# Altium project Inv_filter_v1.PrjPcb (part 1 of 2)
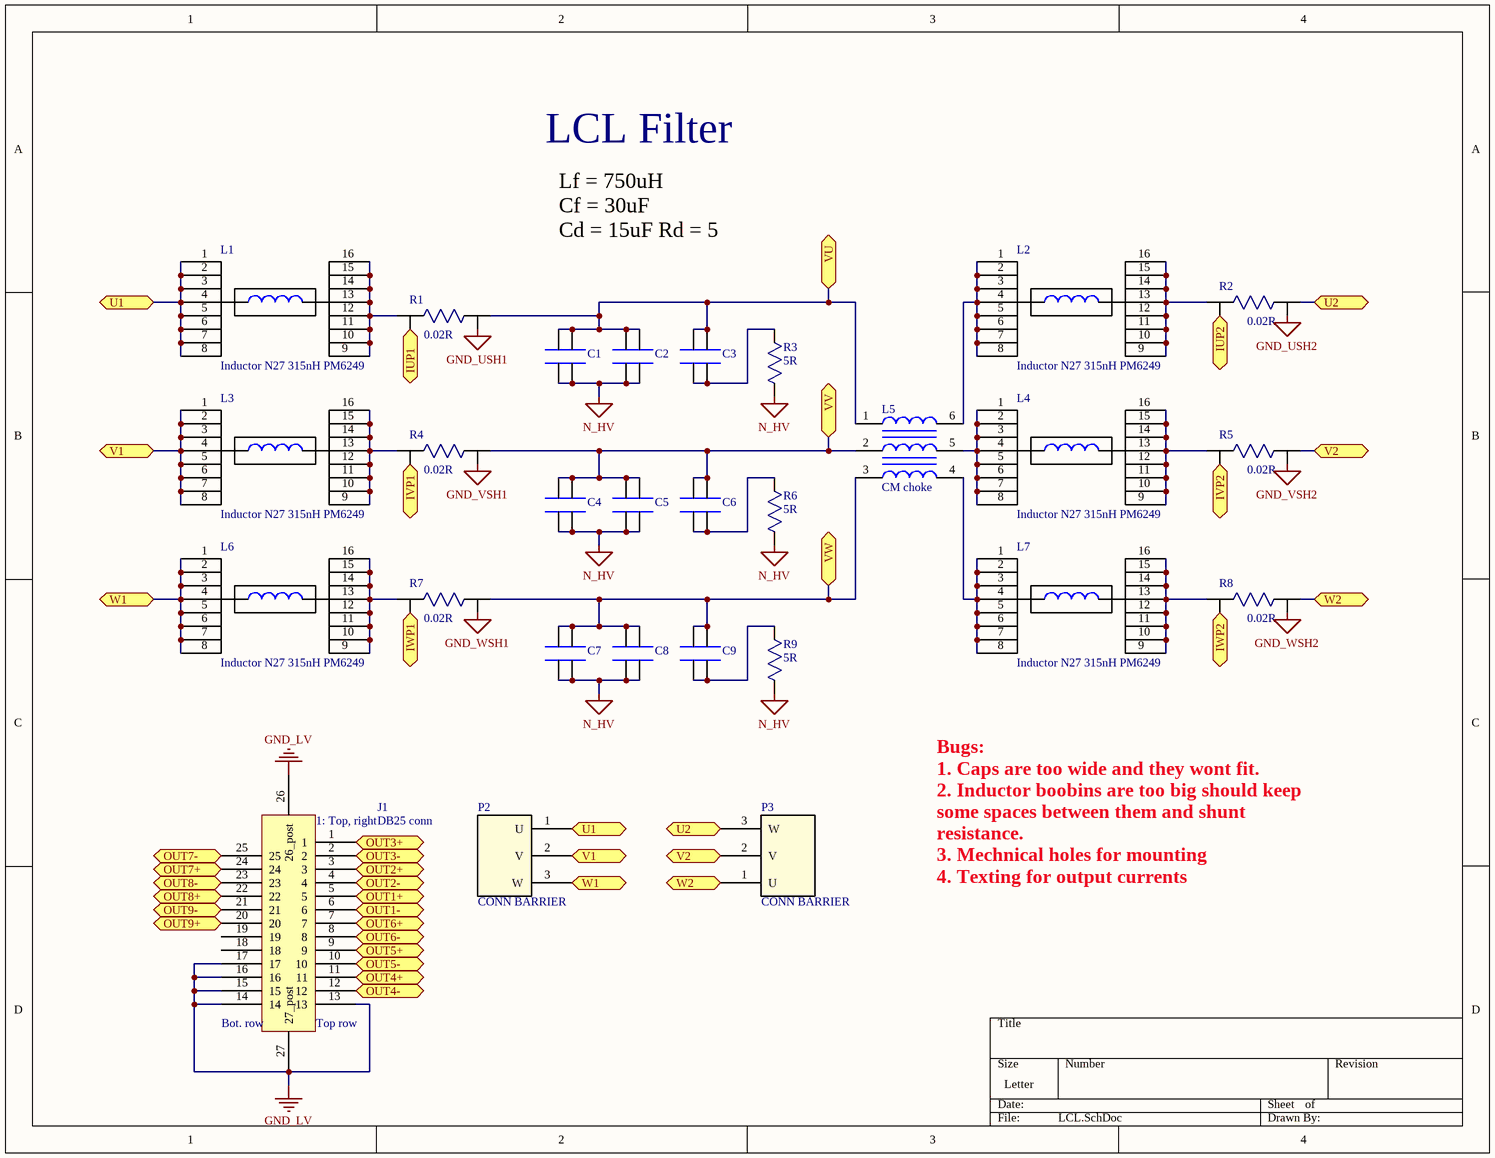
[diagram p0: LCL.SchDoc]
5 sheets, 433 parts. Net scope: flat (ports and power ports of the same name join across sheets).
Board file: Inc_filter_v1.PcbDoc
Sheets:
  LCL.SchDoc
  Ind_current_sensor_VW.SchDoc
  Ind_current_sensor_U.SchDoc
  Voltage_sensor_UVW.SchDoc
  Out_current_sensor_UVW.SchDoc

## Sheet LCL.SchDoc
size Letter

### Parts
C1  *  [Radial - 4 Leads]  (value not drawn)
C2  *  [Radial - 4 Leads]  (value not drawn)
C3  *  [Radial - 4 Leads]  (value not drawn)
C4  *  [Radial - 4 Leads]  (value not drawn)
C5  *  [Radial - 4 Leads]  (value not drawn)
C6  *  [Radial - 4 Leads]  (value not drawn)
C7  *  [Radial - 4 Leads]  (value not drawn)
C8  *  [Radial - 4 Leads]  (value not drawn)
C9  *  [Radial - 4 Leads]  (value not drawn)
J1  DB25 conn  [Connector D-Sub Receptacle 25 pos]
L1  Inductor N27 315nH PM6249  [IND_PM6249]
L2  Inductor N27 315nH PM6249  [IND_PM6249]
L3  Inductor N27 315nH PM6249  [IND_PM6249]
L4  Inductor N27 315nH PM6249  [IND_PM6249]
L5  CM choke  [CM Choke]
L6  Inductor N27 315nH PM6249  [IND_PM6249]
L7  Inductor N27 315nH PM6249  [IND_PM6249]
P2  CONN BARRIER  [Terminal Barrier 3PIN]
P3  CONN BARRIER  [Terminal Barrier 3PIN]
R1  value 0.02R  [Res Precision CSM3637Z]  (hidden comment: Resistor Precision)
R2  value 0.02R  [Res Precision CSM3637Z]  (hidden comment: Resistor Precision)
R3  value 5R  [Axial 50mm]  (hidden comment: Resistor Power)
R4  value 0.02R  [Res Precision CSM3637Z]  (hidden comment: Resistor Precision)
R5  value 0.02R  [Res Precision CSM3637Z]  (hidden comment: Resistor Precision)
R6  value 5R  [Axial 50mm]  (hidden comment: Resistor Power)
R7  value 0.02R  [Res Precision CSM3637Z]  (hidden comment: Resistor Precision)
R8  value 0.02R  [Res Precision CSM3637Z]  (hidden comment: Resistor Precision)
R9  value 5R  [Axial 50mm]  (hidden comment: Resistor Power)

### Ports
IUP1, IUP2, IVP1, IVP2, IWP1, IWP2, OUT1+, OUT1-, OUT2+, OUT2-, OUT3+, OUT3-, OUT4+, OUT4-, OUT5+, OUT5-, OUT6+, OUT6-, OUT7+, OUT7-, OUT8+, OUT8-, OUT9+, OUT9-, U1, U2, V1, V2, VU, VV, VW, W1, W2

### Nets
GND_LV: J1.13 J1.14 J1.15 J1.16 J1.17 J1.26(26_post) J1.27(27_post)
GND_USH1: R1.2
GND_USH2: R2.2
GND_VSH1: R4.2
GND_VSH2: R5.2
GND_WSH1: R7.2
GND_WSH2: R8.2
N_HV: C1.1(OUT) C1.2(OUT) C2.1(OUT) C2.2(OUT) C4.1(OUT) C4.2(OUT) C5.1(OUT) C5.2(OUT) C7.1(OUT) C7.2(OUT) C8.1(OUT) C8.2(OUT) R3.1 R6.1 R9.1
NetC1_3: C1.3(OUT) C1.4(OUT) C2.3(OUT) C2.4(OUT) C3.3(OUT) C3.4(OUT) L5.1 R1.1 ; port VU
NetC3_1: C3.1(OUT) C3.2(OUT) R3.2
NetC4_3: C4.3(OUT) C4.4(OUT) C5.3(OUT) C5.4(OUT) C6.3(OUT) C6.4(OUT) L5.2 R4.1 ; port VV
NetC6_1: C6.1(OUT) C6.2(OUT) R6.2
NetC7_3: C7.3(OUT) C7.4(OUT) C8.3(OUT) C8.4(OUT) C9.3(OUT) C9.4(OUT) L5.3 R7.1 ; port VW
NetC9_1: C9.1(OUT) C9.2(OUT) R9.2
NetFB1_1: R4.3 ; port IVP1
NetFB5_1: R1.3 ; port IUP1
NetFB9_1: R7.3 ; port IWP1
NetFB18_1: R2.3 ; port IUP2
NetFB22_1: R5.3 ; port IVP2
NetFB26_1: R8.3 ; port IWP2
NetJ1_1: J1.1 ; port OUT3+
NetJ1_2: J1.2 ; port OUT3-
NetJ1_3: J1.3 ; port OUT2+
NetJ1_4: J1.4 ; port OUT2-
NetJ1_5: J1.5 ; port OUT1+
NetJ1_6: J1.6 ; port OUT1-
NetJ1_7: J1.7 ; port OUT6+
NetJ1_8: J1.8 ; port OUT6-
NetJ1_9: J1.9 ; port OUT5+
NetJ1_10: J1.10 ; port OUT5-
NetJ1_11: J1.11 ; port OUT4+
NetJ1_12: J1.12 ; port OUT4-
NetJ1_20: J1.20 ; port OUT9+
NetJ1_21: J1.21 ; port OUT9-
NetJ1_22: J1.22 ; port OUT8+
NetJ1_23: J1.23 ; port OUT8-
NetJ1_24: J1.24 ; port OUT7+
NetJ1_25: J1.25 ; port OUT7-
NetL1_1: L1.1 L1.2 L1.3 L1.4 L1.5 L1.6 L1.7 L1.8 P2.1(U) ; port U1
NetL1_9: L1.9 L1.10 L1.11 L1.12 L1.13 L1.14 L1.15 L1.16 R1.4
NetL2_1: L2.1 L2.2 L2.3 L2.4 L2.5 L2.6 L2.7 L2.8 L5.6
NetL2_9: L2.9 L2.10 L2.11 L2.12 L2.13 L2.14 L2.15 L2.16 R2.4
NetL3_1: L3.1 L3.2 L3.3 L3.4 L3.5 L3.6 L3.7 L3.8 P2.2(V) ; port V1
NetL3_9: L3.9 L3.10 L3.11 L3.12 L3.13 L3.14 L3.15 L3.16 R4.4
NetL4_1: L4.1 L4.2 L4.3 L4.4 L4.5 L4.6 L4.7 L4.8 L5.5
NetL4_9: L4.9 L4.10 L4.11 L4.12 L4.13 L4.14 L4.15 L4.16 R5.4
NetL5_4: L5.4 L7.1 L7.2 L7.3 L7.4 L7.5 L7.6 L7.7 L7.8
NetL6_1: L6.1 L6.2 L6.3 L6.4 L6.5 L6.6 L6.7 L6.8 P2.3(W) ; port W1
NetL6_9: L6.9 L6.10 L6.11 L6.12 L6.13 L6.14 L6.15 L6.16 R7.4
NetL7_9: L7.9 L7.10 L7.11 L7.12 L7.13 L7.14 L7.15 L7.16 R8.4
NetP3_1: P3.1(U) R8.1 ; port W2
NetP3_2: P3.2(V) R5.1 ; port V2
NetP3_3: P3.3(W) R2.1 ; port U2

Not connected (* = marked no-connect by the designer): J1 18 19

### Notes on the sheet
- LCL Filter
- Lf = 750uH
  Cf = 30uF
  Cd = 15uF Rd = 5
  Lm = 300uH
- Bugs:
  1. Caps are too wide and they wont fit.
  2. Inductor boobins are too big should keep some spaces between them and shunt resistance.
  3. Mechnical holes for mounting
  4. Texting for output currents
- (in symbol Conn D-Sub Receptacle 25 positions) 1: Top, right; Bot. row; Top row

### Library data of the parts
C1-C9 = Cap Film Radial - 4 Leads: Radial - 4 Leads; Part: BC2763-ND
J1 = Conn D-Sub Receptacle 25 positions: D-Sub Receptacle 25 Position A35111-ND; Part: A35111-ND
L5 = CMC 1.5MH 20A: CMC 1.5MH 20A 3LN TH; Part: B82747E6203A40
P2 P3 = Terminal Blocks - Barrier Blocks: CONN BARRIER STRIP 3CIRC 0.325"; Part: WM4246-ND
R1 R2 R4 R5 R7 R8 = Resistor Precision: RES SMD 0.02 OHM 0.1% 2W 3637; Part: Y1473-.02CCT-ND
R3 R6 R9 = Resistor Power: RES 5.0 OHM 10W 1% WW AXIAL; Part: RSD-5.0RCT-ND

## Sheet Ind_current_sensor_VW.SchDoc
size 304 x 482 mm
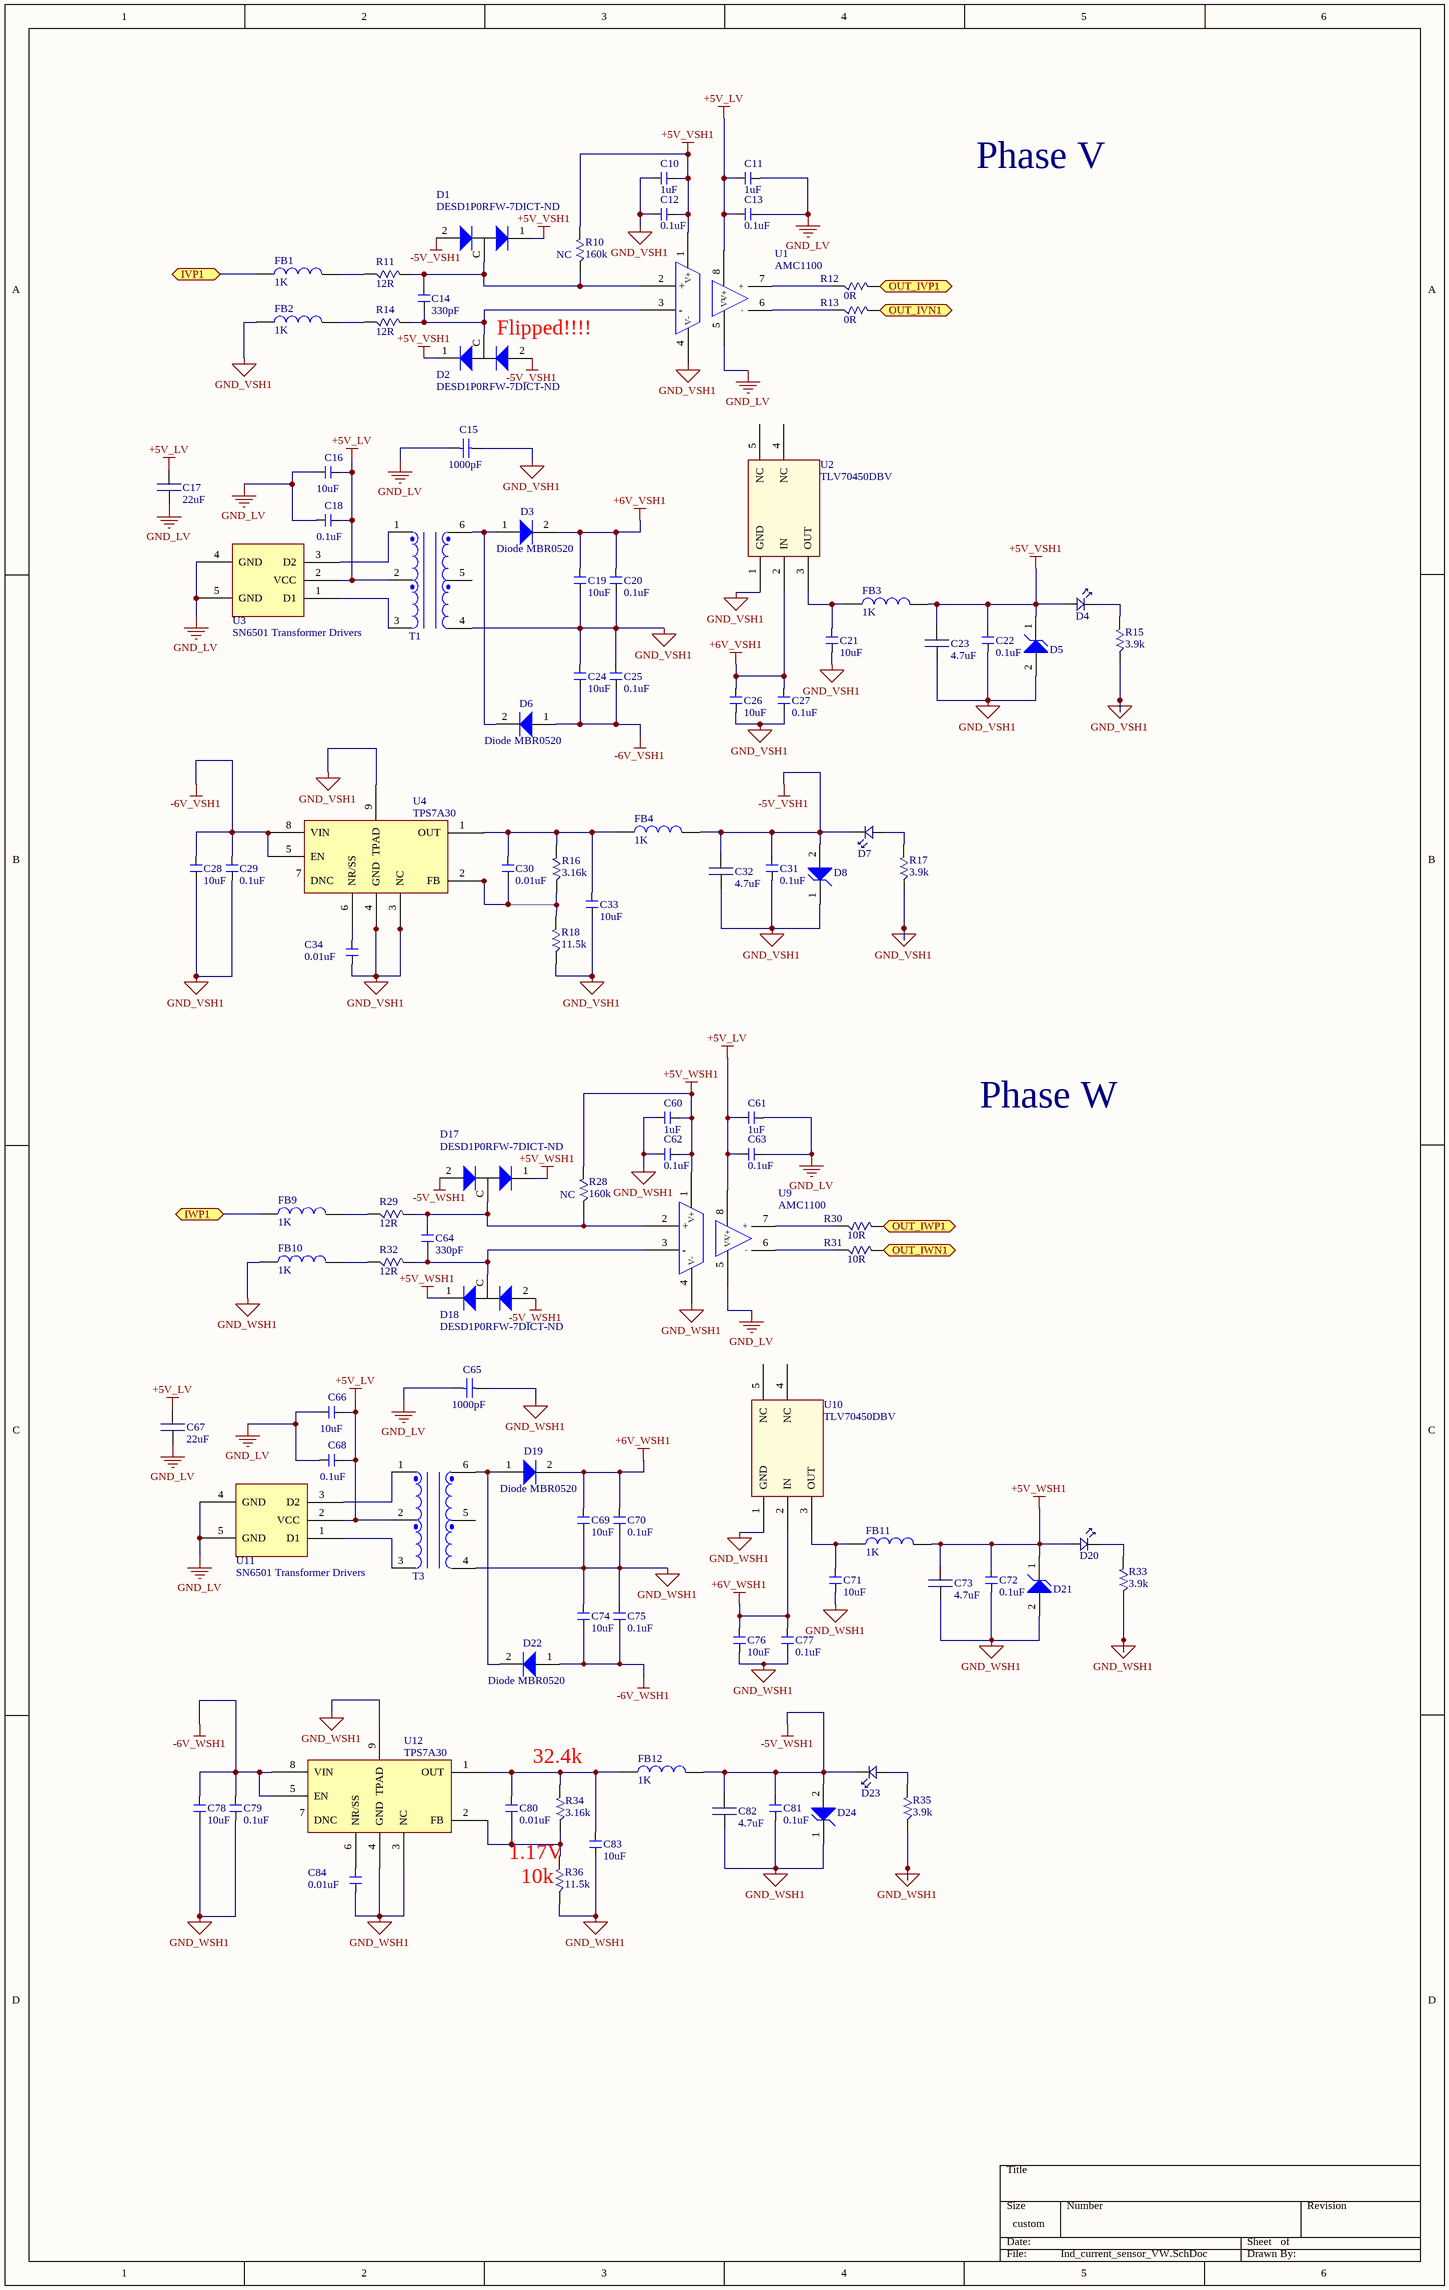
[diagram p1: Ind_current_sensor_VW.SchDoc]

### Parts
C10  value 1uF  [0603 (1608 Metric)]  (hidden comment: Cap 0603_new)
C11  value 1uF  [0603 (1608 Metric)]  (hidden comment: Cap 0603_new)
C12  value 0.1uF  [0603 (1608 Metric)]  (hidden comment: Cap 0603_new)
C13  value 0.1uF  [0603 (1608 Metric)]  (hidden comment: Cap 0603_new)
C14  value 330pF  [0603 (1608 Metric)]  (hidden comment: Cap 0603_new)
C15  value 1000pF  [RAD-0.3]  (hidden comment: Cap TH)
C16  value 10uF  [0603 (1608 Metric)]  (hidden comment: Cap 0603_new)
C17  value 22uF  [0805 (2012 metric)]  (hidden comment: Cap 0805)
C18  value 0.1uF  [0603 (1608 Metric)]  (hidden comment: Cap 0603_new)
C19  value 10uF  [0603 (1608 Metric)]  (hidden comment: Cap 0603_new)
C20  value 0.1uF  [0603 (1608 Metric)]  (hidden comment: Cap 0603_new)
C21  value 10uF  [0603 (1608 Metric)]  (hidden comment: Cap 0603_new)
C22  value 0.1uF  [0603 (1608 Metric)]  (hidden comment: Cap 0603_new)
C23  value 4.7uF  [0805 (2012 metric)]  (hidden comment: Cap 0805)
C24  value 10uF  [0603 (1608 Metric)]  (hidden comment: Cap 0603_new)
C25  value 0.1uF  [0603 (1608 Metric)]  (hidden comment: Cap 0603_new)
C26  value 10uF  [0603 (1608 Metric)]  (hidden comment: Cap 0603_new)
C27  value 0.1uF  [0603 (1608 Metric)]  (hidden comment: Cap 0603_new)
C28  value 10uF  [0603 (1608 Metric)]  (hidden comment: Cap 0603_new)
C29  value 0.1uF  [0603 (1608 Metric)]  (hidden comment: Cap 0603_new)
C30  value 0.01uF  [0603 (1608 Metric)]  (hidden comment: Cap 0603_new)
C31  value 0.1uF  [0603 (1608 Metric)]  (hidden comment: Cap 0603_new)
C32  value 4.7uF  [0805 (2012 metric)]  (hidden comment: Cap 0805)
C33  value 10uF  [0603 (1608 Metric)]  (hidden comment: Cap 0603_new)
C34  value 0.01uF  [0603 (1608 Metric)]  (hidden comment: Cap 0603_new)
C60  value 1uF  [0603 (1608 Metric)]  (hidden comment: Cap 0603_new)
C61  value 1uF  [0603 (1608 Metric)]  (hidden comment: Cap 0603_new)
C62  value 0.1uF  [0603 (1608 Metric)]  (hidden comment: Cap 0603_new)
C63  value 0.1uF  [0603 (1608 Metric)]  (hidden comment: Cap 0603_new)
C64  value 330pF  [0603 (1608 Metric)]  (hidden comment: Cap 0603_new)
C65  value 1000pF  [RAD-0.3]  (hidden comment: Cap TH)
C66  value 10uF  [0603 (1608 Metric)]  (hidden comment: Cap 0603_new)
C67  value 22uF  [0805 (2012 metric)]  (hidden comment: Cap 0805)
C68  value 0.1uF  [0603 (1608 Metric)]  (hidden comment: Cap 0603_new)
C69  value 10uF  [0603 (1608 Metric)]  (hidden comment: Cap 0603_new)
C70  value 0.1uF  [0603 (1608 Metric)]  (hidden comment: Cap 0603_new)
C71  value 10uF  [0603 (1608 Metric)]  (hidden comment: Cap 0603_new)
C72  value 0.1uF  [0603 (1608 Metric)]  (hidden comment: Cap 0603_new)
C73  value 4.7uF  [0805 (2012 metric)]  (hidden comment: Cap 0805)
C74  value 10uF  [0603 (1608 Metric)]  (hidden comment: Cap 0603_new)
C75  value 0.1uF  [0603 (1608 Metric)]  (hidden comment: Cap 0603_new)
C76  value 10uF  [0603 (1608 Metric)]  (hidden comment: Cap 0603_new)
C77  value 0.1uF  [0603 (1608 Metric)]  (hidden comment: Cap 0603_new)
C78  value 10uF  [0603 (1608 Metric)]  (hidden comment: Cap 0603_new)
C79  value 0.1uF  [0603 (1608 Metric)]  (hidden comment: Cap 0603_new)
C80  value 0.01uF  [0603 (1608 Metric)]  (hidden comment: Cap 0603_new)
C81  value 0.1uF  [0603 (1608 Metric)]  (hidden comment: Cap 0603_new)
C82  value 4.7uF  [0805 (2012 metric)]  (hidden comment: Cap 0805)
C83  value 10uF  [0603 (1608 Metric)]  (hidden comment: Cap 0603_new)
C84  value 0.01uF  [0603 (1608 Metric)]  (hidden comment: Cap 0603_new)
D1  Part: DESD1P0RFW-7DICT-ND  [SOT323_ESD]  (hidden comment: TVS - Diodes)
D2  Part: DESD1P0RFW-7DICT-ND  [SOT323_ESD]  (hidden comment: TVS - Diodes)
D3  Diode MBR0520  [SOD-123]
D4  LED  [0805 (2012 Metric) Diode]  (value not drawn)
D5  *  [POWERDI]  (value not drawn)
D6  Diode MBR0520  [SOD-123]
D7  LED  [0805 (2012 Metric) Diode]  (value not drawn)
D8  *  [POWERDI]  (value not drawn)
D17  Part: DESD1P0RFW-7DICT-ND  [SOT323_ESD]  (hidden comment: TVS - Diodes)
D18  Part: DESD1P0RFW-7DICT-ND  [SOT323_ESD]  (hidden comment: TVS - Diodes)
D19  Diode MBR0520  [SOD-123]
D20  LED  [0805 (2012 Metric) Diode]  (value not drawn)
D21  *  [POWERDI]  (value not drawn)
D22  Diode MBR0520  [SOD-123]
D23  LED  [0805 (2012 Metric) Diode]  (value not drawn)
D24  *  [POWERDI]  (value not drawn)
FB1  value 1K  [0603 (1608 Metric)]  (hidden comment: Ferrite bead)
FB2  value 1K  [0603 (1608 Metric)]  (hidden comment: Ferrite bead)
FB3  value 1K  [0603 (1608 Metric)]  (hidden comment: Ferrite bead)
FB4  value 1K  [0603 (1608 Metric)]  (hidden comment: Ferrite bead)
FB9  value 1K  [0603 (1608 Metric)]  (hidden comment: Ferrite bead)
FB10  value 1K  [0603 (1608 Metric)]  (hidden comment: Ferrite bead)
FB11  value 1K  [0603 (1608 Metric)]  (hidden comment: Ferrite bead)
FB12  value 1K  [0603 (1608 Metric)]  (hidden comment: Ferrite bead)
R10  NC  value 160k  [0603 (1608 Metric)]
R11  value 12R  [1206]  (hidden comment: Resistor 1206)
R12  value 0R  [0603 (1608 Metric)]  (hidden comment: Resistor 0603)
R13  value 0R  [0603 (1608 Metric)]  (hidden comment: Resistor 0603)
R14  value 12R  [1206]  (hidden comment: Resistor 1206)
R15  value 3.9k  [0603 (1608 Metric)]  (hidden comment: Resistor 0603)
R16  value 3.16k  [0603 (1608 Metric)]  (hidden comment: Resistor 0603)
R17  value 3.9k  [0603 (1608 Metric)]  (hidden comment: Resistor 0603)
R18  value 11.5k  [0603 (1608 Metric)]  (hidden comment: Resistor 0603)
R28  NC  value 160k  [0603 (1608 Metric)]
R29  value 12R  [1206]  (hidden comment: Resistor 1206)
R30  value 10R  [0603 (1608 Metric)]  (hidden comment: Resistor 0603)
R31  value 10R  [0603 (1608 Metric)]  (hidden comment: Resistor 0603)
R32  value 12R  [1206]  (hidden comment: Resistor 1206)
R33  value 3.9k  [0603 (1608 Metric)]  (hidden comment: Resistor 0603)
R34  value 3.16k  [0603 (1608 Metric)]  (hidden comment: Resistor 0603)
R35  value 3.9k  [0603 (1608 Metric)]  (hidden comment: Resistor 0603)
R36  value 11.5k  [0603 (1608 Metric)]  (hidden comment: Resistor 0603)
T1  750313769  [Xmr SN6501]  (value not drawn)
T3  750313769  [Xmr SN6501]  (value not drawn)
U1  AMC1100  [SOIC8]
U2  TLV70450DBV  [SOT23-5]
U3  SN6501 Transformer Drivers  [SOT23-5]
U4  TPS7A30  [8-TSSOP]
U9  AMC1100  [SOIC8]
U10  TLV70450DBV  [SOT23-5]
U11  SN6501 Transformer Drivers  [SOT23-5]
U12  TPS7A30  [8-TSSOP]

### Ports
IVP1, IWP1, OUT_IVN1, OUT_IVP1, OUT_IWN1, OUT_IWP1

### Nets
+5V_LV: C11.1(OUT) C13.1(OUT) C16.2(OUT) C17.2(OUT) C18.2(OUT) C61.1(OUT) C63.1(OUT) C66.2(OUT) C67.2(OUT) C68.2(OUT) T1.2 T3.2 U1.8(V+) U3.2(VCC) U9.8(V+) U11.2(VCC)
+5V_VSH1: C10.2(OUT) C12.2(OUT) C22.2(OUT) C23.2(OUT) D1.1(Anode) D2.1(Anode) D4.A D5.1(Anode) FB3.2(OUT) R10.2(A) U1.1(V+)
+5V_WSH1: C60.2(OUT) C62.2(OUT) C72.2(OUT) C73.2(OUT) D17.1(Anode) D18.1(Anode) D20.A D21.1(Anode) FB11.2(OUT) R28.2(A) U9.1(V+)
+6V_VSH1: C19.2(OUT) C20.2(OUT) C26.2(OUT) C27.2(OUT) D3.2(Anode) U2.2(IN)
+6V_WSH1: C69.2(OUT) C70.2(OUT) C76.2(OUT) C77.2(OUT) D19.2(Anode) U10.2(IN)
-5V_VSH1: C31.2(OUT) C32.2(OUT) D1.2(Anode) D2.2(Anode) D7.K D8.2(Anode) FB4.2(OUT)
-5V_WSH1: C81.2(OUT) C82.2(OUT) D17.2(Anode) D18.2(Anode) D23.K D24.2(Anode) FB12.2(OUT)
-6V_VSH1: C24.1(OUT) C25.1(OUT) C28.2(OUT) C29.2(OUT) D6.1(Anode) U4.5(EN) U4.8(VIN)
-6V_WSH1: C74.1(OUT) C75.1(OUT) C78.2(OUT) C79.2(OUT) D22.1(Anode) U12.5(EN) U12.8(VIN)
GND_LV: C11.2(OUT) C13.2(OUT) C15.1 C16.1(OUT) C17.1(OUT) C18.1(OUT) C61.2(OUT) C63.2(OUT) C65.1 C66.1(OUT) C67.1(OUT) C68.1(OUT) U1.5(V-) U3.4(GND) U3.5(GND) U9.5(V-) U11.4(GND) U11.5(GND)
GND_VSH1: C10.1(OUT) C12.1(OUT) C15.2 C19.1(OUT) C20.1(OUT) C21.1(OUT) C22.1(OUT) C23.1(OUT) C24.2(OUT) C25.2(OUT) C26.1(OUT) C27.1(OUT) C28.1(OUT) C29.1(OUT) C31.1(OUT) C32.1(OUT) C33.1(OUT) C34.1(OUT) D5.2(Anode) D8.1(Anode) FB2.1(OUT) R15.1(A) R17.1(A) R18.1(A) T1.4 U1.4(V-) U2.1(GND) U4.3(NC) U4.4(GND) U4.9(TPAD)
GND_WSH1: C60.1(OUT) C62.1(OUT) C65.2 C69.1(OUT) C70.1(OUT) C71.1(OUT) C72.1(OUT) C73.1(OUT) C74.2(OUT) C75.2(OUT) C76.1(OUT) C77.1(OUT) C78.1(OUT) C79.1(OUT) C81.1(OUT) C82.1(OUT) C83.1(OUT) C84.1(OUT) D21.2(Anode) D24.1(Anode) FB10.1(OUT) R33.1(A) R35.1(A) R36.1(A) T3.4 U9.4(V-) U10.1(GND) U12.3(NC) U12.4(GND) U12.9(TPAD)
NetC14_1: C14.1(OUT) D1.C(Cathode) R10.1(A) R11.2(A) U1.2(+)
NetC14_2: C14.2(OUT) D2.C(Cathode) R14.2(A) U1.3(-)
NetC21_2: C21.2(OUT) FB3.1(OUT) U2.3(OUT)
NetC30_1: C30.1(OUT) C33.2(OUT) FB4.1(OUT) R16.2(A) U4.1(OUT)
NetC30_2: C30.2(OUT) R16.1(A) R18.2(A) U4.2(FB)
NetC34_2: C34.2(OUT) U4.6(NR/SS)
NetC64_1: C64.1(OUT) D17.C(Cathode) R28.1(A) R29.2(A) U9.2(+)
NetC64_2: C64.2(OUT) D18.C(Cathode) R32.2(A) U9.3(-)
NetC71_2: C71.2(OUT) FB11.1(OUT) U10.3(OUT)
NetC80_1: C80.1(OUT) C83.2(OUT) FB12.1(OUT) R34.2(A) U12.1(OUT)
NetC80_2: C80.2(OUT) R34.1(A) R36.2(A) U12.2(FB)
NetC84_2: C84.2(OUT) U12.6(NR/SS)
NetD3_1: D3.1(Anode) D6.2(Anode) T1.6
NetD4_K: D4.K R15.2(A)
NetD7_A: D7.A R17.2(A)
NetD19_1: D19.1(Anode) D22.2(Anode) T3.6
NetD20_K: D20.K R33.2(A)
NetD23_A: D23.A R35.2(A)
NetFB1_1: FB1.1(OUT) ; port IVP1
NetFB1_2: FB1.2(OUT) R11.1(A)
NetFB2_2: FB2.2(OUT) R14.1(A)
NetFB9_1: FB9.1(OUT) ; port IWP1
NetFB9_2: FB9.2(OUT) R29.1(A)
NetFB10_2: FB10.2(OUT) R32.1(A)
NetR12_1: R12.1(A) U1.7(+)
NetR12_2: R12.2(A) ; port OUT_IVP1
NetR13_1: R13.1(A) U1.6(-)
NetR13_2: R13.2(A) ; port OUT_IVN1
NetR30_1: R30.1(A) U9.7(+)
NetR30_2: R30.2(A) ; port OUT_IWP1
NetR31_1: R31.1(A) U9.6(-)
NetR31_2: R31.2(A) ; port OUT_IWN1
NetT1_1: T1.1 U3.3(D2)
NetT1_3: T1.3 U3.1(D1)
NetT3_1: T3.1 U11.3(D2)
NetT3_3: T3.3 U11.1(D1)

Not connected (* = marked no-connect by the designer): T1 5(1); T3 5(1); U2 4(NC) 5(NC); U4 7(DNC); U10 4(NC) 5(NC); U12 7(DNC)

### Notes on the sheet
- Phase V
- (near D2) Flipped!!!!
- Phase W
- 32.4k
- (near R36) 1.17V
- (near R36) 10k

### Library data of the parts
C10 C11 C60 C61 = Cap 0603_new: CAP CER 1UF 50V X5R 0603; part: 1276-1860-1-ND
C12 C13 C18 C20 C22 C25 C27 C29 C31 C62 C63 C68 C70 C72 C75 C77 C79 C81 = Cap 0603_new: CAP CER 0.1UF 50V Y5V 0603; part: 311-1343-6-ND
C14 C64 = Cap 0603_new: CAP CER 330PF 50V C0G 0603; part: 445-7033-2-ND
C15 C65 = Cap: CAP CER 1000PF 1KV Y5P RADIAL; Part: 1251PH-ND; Published: 8-Jun-2000; LatestRevisionDate: 17-Jul-2002; LatestRevisionNote: Re-released for DXP Platform.; PackageReference: RAD-0.3; Publisher: Altium Limited; PackageDescription: Radial Cap, Thru-Hole; 2 Leads; 0.3 in Pin Spacing
C16 C19 C21 C24 C26 C28 C33 C66 C69 C71 C74 C76 C78 C83 = Cap 0603_new: CAP CER 10UF 35V X5R 0805; part: 490-10515-1-ND
C17 C67 = Cap 0805: CAP CER 22UF 35V X5R 0805; Part: 445-14428-1-ND
C23 C32 C73 C82 = Cap 0805: CAP CER 4.7UF 50V X5R 0805; Part: 445-5980-1-ND
C30 C34 C80 C84 = Cap 0603_new: CAP CER 10000PF 100V X7R 0603; part: 478-7418-1-ND
D1 D2 D17 D18 = Diode_ESD: TVS DIODE 70VWM 8VC SOT323; Value: ESD
D3 D6 D19 D22 = Diode MBR0520: DIODE SCHOTTKY 20V 500MA SOD123; Part: MBR0520LT1GOSCT-ND; Value: *
D4 D7 D20 D23 = LED: LED 0805
D5 D8 D21 D24 = Diode Zener POWERDI123: Part: MMSZ5228B-FDICT-ND; Value: *
FB1-FB4 FB9-FB12 = Ferrite bead: FERRITE BEAD 1 KOHM 0603 1LN; Part: 445-8672-1-ND
R10 R28 = Resistor 0603
R11 R14 R29 R32 = Resistor 1206: 12 Ohm ±0.5% 0.25W, 1/4W Chip Resistor 1206; Part: 311-2961-1-ND
R12 R13 R30 R31 = Resistor 0603: RES SMD 10 OHM 0.05% 1/10W 0603; Part: RNCF0603AKT10R0CT-ND
R15 R17 R33 R35 = Resistor 0603: RES SMD 3.9K OHM 5% 1/10W 0603; Part: 541-3.9KGCT-ND
R16 R34 = Resistor 0603: RES SMD 3.16K OHM 1% 1/10W 0603; Part: 311-3.16KHRCT-ND
R18 R36 = Resistor 0603: RES SMD 11.5K OHM 1% 1/10W 0603; Part: 541-11.5KHCT-ND
T1 T3 = 750313769: TRANSFORMER SMD TR1.7 SN6501; Part: 1297-1107-1-ND
U1 U9 = AMC1100: IC OPAMP ISOLATION 100KHZ 8SOIC; Part: 296-38822-5-ND
U2 U10 = TLV70450DBV: IC REG LDO 5V 0.15A SOT23-5; Part: 296-39287-1-ND
U3 U11 = SN6501: IC REG CONV PWR SUPPLIES SOT23-5; Part: 296-37700-1-ND; Value: *
U4 U12 = TPS7A30: IC REG LDO NEG ADJ 0.2A 8MSOP; Part: 296-27750-1-ND

## Sheet Ind_current_sensor_U.SchDoc
size Letter
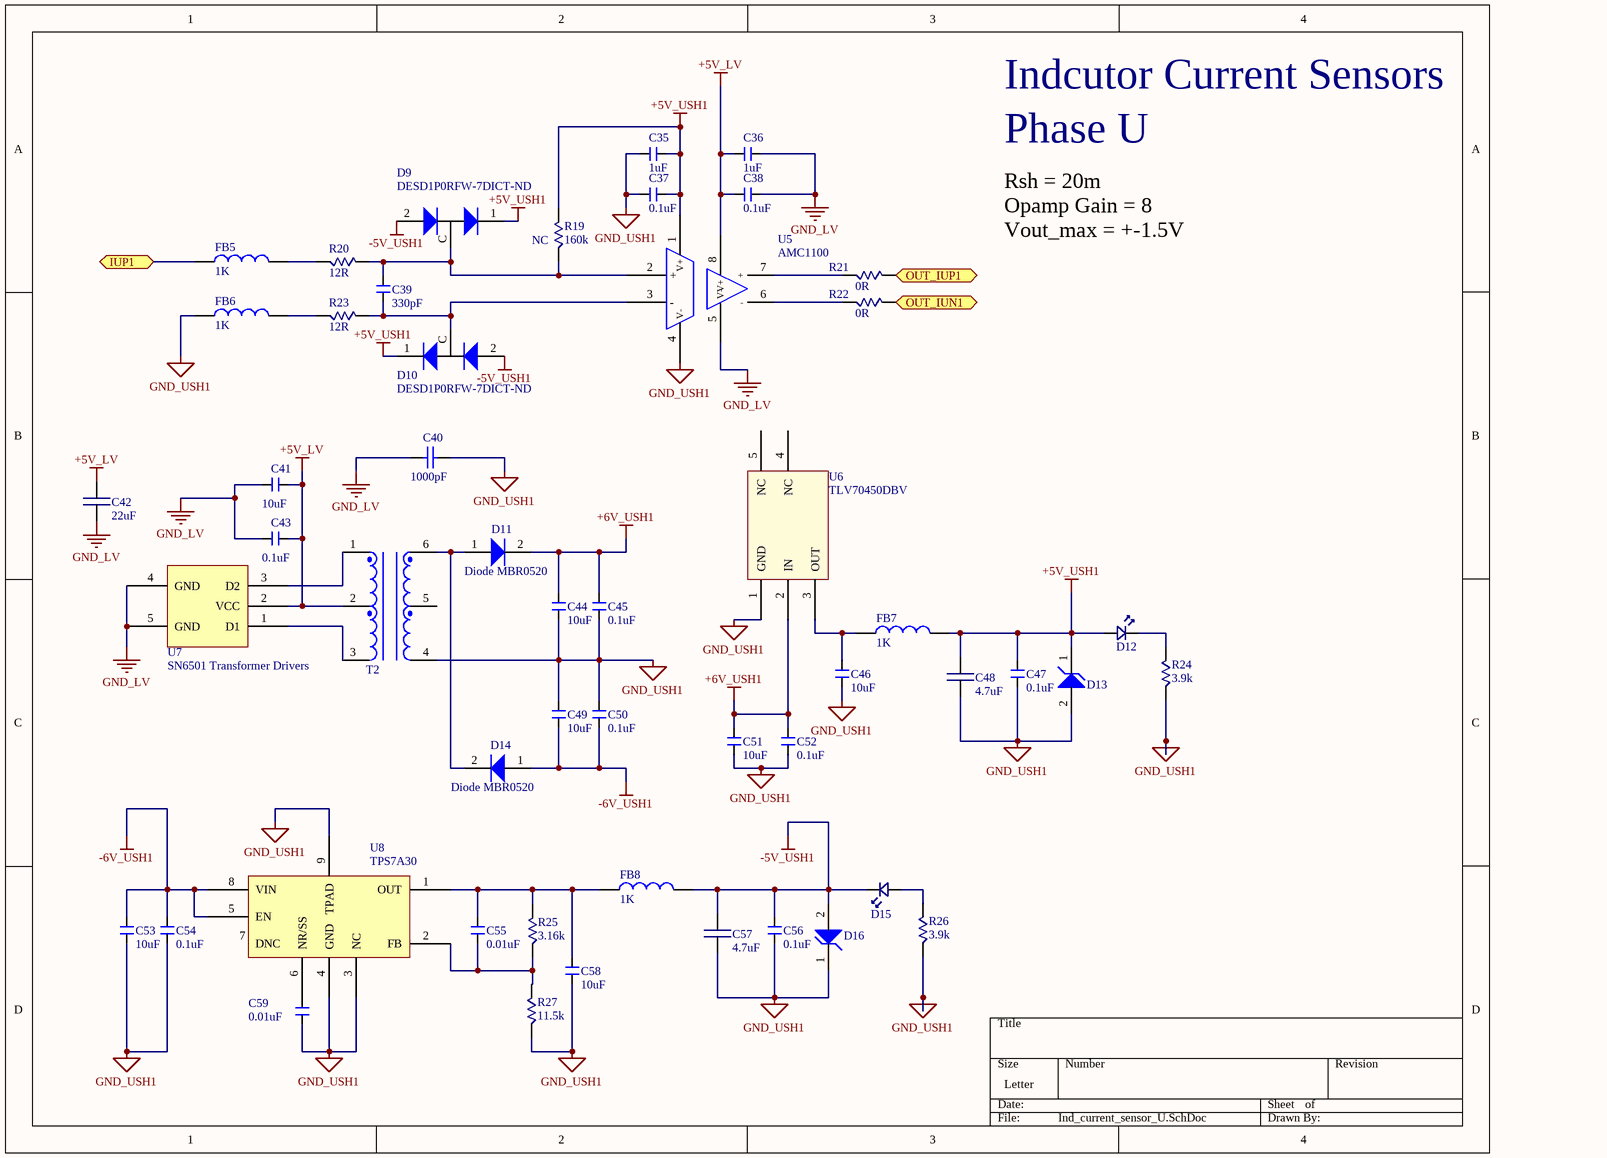
[diagram p2: Ind_current_sensor_U.SchDoc]

### Parts
C35  value 1uF  [0603 (1608 Metric)]  (hidden comment: Cap 0603_new)
C36  value 1uF  [0603 (1608 Metric)]  (hidden comment: Cap 0603_new)
C37  value 0.1uF  [0603 (1608 Metric)]  (hidden comment: Cap 0603_new)
C38  value 0.1uF  [0603 (1608 Metric)]  (hidden comment: Cap 0603_new)
C39  value 330pF  [0603 (1608 Metric)]  (hidden comment: Cap 0603_new)
C40  value 1000pF  [RAD-0.3]  (hidden comment: Cap TH)
C41  value 10uF  [0603 (1608 Metric)]  (hidden comment: Cap 0603_new)
C42  value 22uF  [0805 (2012 metric)]  (hidden comment: Cap 0805)
C43  value 0.1uF  [0603 (1608 Metric)]  (hidden comment: Cap 0603_new)
C44  value 10uF  [0603 (1608 Metric)]  (hidden comment: Cap 0603_new)
C45  value 0.1uF  [0603 (1608 Metric)]  (hidden comment: Cap 0603_new)
C46  value 10uF  [0603 (1608 Metric)]  (hidden comment: Cap 0603_new)
C47  value 0.1uF  [0603 (1608 Metric)]  (hidden comment: Cap 0603_new)
C48  value 4.7uF  [0805 (2012 metric)]  (hidden comment: Cap 0805)
C49  value 10uF  [0603 (1608 Metric)]  (hidden comment: Cap 0603_new)
C50  value 0.1uF  [0603 (1608 Metric)]  (hidden comment: Cap 0603_new)
C51  value 10uF  [0603 (1608 Metric)]  (hidden comment: Cap 0603_new)
C52  value 0.1uF  [0603 (1608 Metric)]  (hidden comment: Cap 0603_new)
C53  value 10uF  [0603 (1608 Metric)]  (hidden comment: Cap 0603_new)
C54  value 0.1uF  [0603 (1608 Metric)]  (hidden comment: Cap 0603_new)
C55  value 0.01uF  [0603 (1608 Metric)]  (hidden comment: Cap 0603_new)
C56  value 0.1uF  [0603 (1608 Metric)]  (hidden comment: Cap 0603_new)
C57  value 4.7uF  [0805 (2012 metric)]  (hidden comment: Cap 0805)
C58  value 10uF  [0603 (1608 Metric)]  (hidden comment: Cap 0603_new)
C59  value 0.01uF  [0603 (1608 Metric)]  (hidden comment: Cap 0603_new)
D9  Part: DESD1P0RFW-7DICT-ND  [SOT323_ESD]  (hidden comment: TVS - Diodes)
D10  Part: DESD1P0RFW-7DICT-ND  [SOT323_ESD]  (hidden comment: TVS - Diodes)
D11  Diode MBR0520  [SOD-123]
D12  LED  [0805 (2012 Metric) Diode]  (value not drawn)
D13  *  [POWERDI]  (value not drawn)
D14  Diode MBR0520  [SOD-123]
D15  LED  [0805 (2012 Metric) Diode]  (value not drawn)
D16  *  [POWERDI]  (value not drawn)
FB5  value 1K  [0603 (1608 Metric)]  (hidden comment: Ferrite bead)
FB6  value 1K  [0603 (1608 Metric)]  (hidden comment: Ferrite bead)
FB7  value 1K  [0603 (1608 Metric)]  (hidden comment: Ferrite bead)
FB8  value 1K  [0603 (1608 Metric)]  (hidden comment: Ferrite bead)
R19  NC  value 160k  [0603 (1608 Metric)]
R20  value 12R  [1206]  (hidden comment: Resistor 1206)
R21  value 0R  [0603 (1608 Metric)]  (hidden comment: Resistor 0603)
R22  value 0R  [0603 (1608 Metric)]  (hidden comment: Resistor 0603)
R23  value 12R  [1206]  (hidden comment: Resistor 1206)
R24  value 3.9k  [0603 (1608 Metric)]  (hidden comment: Resistor 0603)
R25  value 3.16k  [0603 (1608 Metric)]  (hidden comment: Resistor 0603)
R26  value 3.9k  [0603 (1608 Metric)]  (hidden comment: Resistor 0603)
R27  value 11.5k  [0603 (1608 Metric)]  (hidden comment: Resistor 0603)
T2  750313769  [Xmr SN6501]  (value not drawn)
U5  AMC1100  [SOIC8]
U6  TLV70450DBV  [SOT23-5]
U7  SN6501 Transformer Drivers  [SOT23-5]
U8  TPS7A30  [8-TSSOP]

### Ports
IUP1, OUT_IUN1, OUT_IUP1

### Nets
+5V_LV: C36.1(OUT) C38.1(OUT) C41.2(OUT) C42.2(OUT) C43.2(OUT) T2.2 U5.8(V+) U7.2(VCC)
+5V_USH1: C35.2(OUT) C37.2(OUT) C47.2(OUT) C48.2(OUT) D9.1(Anode) D10.1(Anode) D12.A D13.1(Anode) FB7.2(OUT) R19.2(A) U5.1(V+)
+6V_USH1: C44.2(OUT) C45.2(OUT) C51.2(OUT) C52.2(OUT) D11.2(Anode) U6.2(IN)
-5V_USH1: C56.2(OUT) C57.2(OUT) D9.2(Anode) D10.2(Anode) D15.K D16.2(Anode) FB8.2(OUT)
-6V_USH1: C49.1(OUT) C50.1(OUT) C53.2(OUT) C54.2(OUT) D14.1(Anode) U8.5(EN) U8.8(VIN)
GND_LV: C36.2(OUT) C38.2(OUT) C40.1 C41.1(OUT) C42.1(OUT) C43.1(OUT) U5.5(V-) U7.4(GND) U7.5(GND)
GND_USH1: C35.1(OUT) C37.1(OUT) C40.2 C44.1(OUT) C45.1(OUT) C46.1(OUT) C47.1(OUT) C48.1(OUT) C49.2(OUT) C50.2(OUT) C51.1(OUT) C52.1(OUT) C53.1(OUT) C54.1(OUT) C56.1(OUT) C57.1(OUT) C58.1(OUT) C59.1(OUT) D13.2(Anode) D16.1(Anode) FB6.1(OUT) R24.1(A) R26.1(A) R27.1(A) T2.4 U5.4(V-) U6.1(GND) U8.3(NC) U8.4(GND) U8.9(TPAD)
NetC39_1: C39.1(OUT) D9.C(Cathode) R19.1(A) R20.2(A) U5.2(+)
NetC39_2: C39.2(OUT) D10.C(Cathode) R23.2(A) U5.3(-)
NetC46_2: C46.2(OUT) FB7.1(OUT) U6.3(OUT)
NetC55_1: C55.1(OUT) C58.2(OUT) FB8.1(OUT) R25.2(A) U8.1(OUT)
NetC55_2: C55.2(OUT) R25.1(A) R27.2(A) U8.2(FB)
NetC59_2: C59.2(OUT) U8.6(NR/SS)
NetD11_1: D11.1(Anode) D14.2(Anode) T2.6
NetD12_K: D12.K R24.2(A)
NetD15_A: D15.A R26.2(A)
NetFB5_1: FB5.1(OUT) ; port IUP1
NetFB5_2: FB5.2(OUT) R20.1(A)
NetFB6_2: FB6.2(OUT) R23.1(A)
NetR21_1: R21.1(A) U5.7(+)
NetR21_2: R21.2(A) ; port OUT_IUP1
NetR22_1: R22.1(A) U5.6(-)
NetR22_2: R22.2(A) ; port OUT_IUN1
NetT2_1: T2.1 U7.3(D2)
NetT2_3: T2.3 U7.1(D1)

Not connected (* = marked no-connect by the designer): T2 5(1); U6 4(NC) 5(NC); U8 7(DNC)

### Notes on the sheet
- Indcutor Current Sensors
- Phase U
- Rsh = 20m
  Opamp Gain = 8
  Vout_max = +-1.5V
  Maximum current = +- 9.375A

### Library data of the parts
C35 C36 = Cap 0603_new: as C10 on sheet Ind_current_sensor_VW
C37 C38 C43 C45 C47 C50 C52 C54 C56 = Cap 0603_new: as C12 on sheet Ind_current_sensor_VW
C39 = Cap 0603_new: as C14 on sheet Ind_current_sensor_VW
C40 = Cap: as C15 on sheet Ind_current_sensor_VW; Published: 8-Jun-2000; LatestRevisionDate: 17-Jul-2002; LatestRevisionNote: Re-released for DXP Platform.; PackageReference: RAD-0.3; Publisher: Altium Limited; PackageDescription: Radial Cap, Thru-Hole; 2 Leads; 0.3 in Pin Spacing
C41 C44 C46 C49 C51 C53 C58 = Cap 0603_new: as C16 on sheet Ind_current_sensor_VW
C42 = Cap 0805: as C17 on sheet Ind_current_sensor_VW
C48 C57 = Cap 0805: as C23 on sheet Ind_current_sensor_VW
C55 C59 = Cap 0603_new: as C30 on sheet Ind_current_sensor_VW
D9 D10 = Diode_ESD: TVS DIODE 70VWM 8VC SOT323; Value: ESD
D11 D14 = Diode MBR0520: as D3 on sheet Ind_current_sensor_VW; Value: *
D12 D15 = LED: LED 0805
D13 D16 = Diode Zener POWERDI123: Part: MMSZ5228B-FDICT-ND; Value: *
FB5-FB8 = Ferrite bead: as FB1 on sheet Ind_current_sensor_VW
R19 = Resistor 0603
R20 R23 = Resistor 1206: as R11 on sheet Ind_current_sensor_VW
R21 R22 = Resistor 0603: as R12 on sheet Ind_current_sensor_VW
R24 R26 = Resistor 0603: as R15 on sheet Ind_current_sensor_VW
R25 = Resistor 0603: as R16 on sheet Ind_current_sensor_VW
R27 = Resistor 0603: as R18 on sheet Ind_current_sensor_VW
T2 = 750313769: as T1 on sheet Ind_current_sensor_VW
U5 = AMC1100: as U1 on sheet Ind_current_sensor_VW
U6 = TLV70450DBV: as U2 on sheet Ind_current_sensor_VW
U7 = SN6501: as U3 on sheet Ind_current_sensor_VW; Value: *
U8 = TPS7A30: as U4 on sheet Ind_current_sensor_VW

## Sheet Voltage_sensor_UVW.SchDoc
size 381 x 457 mm
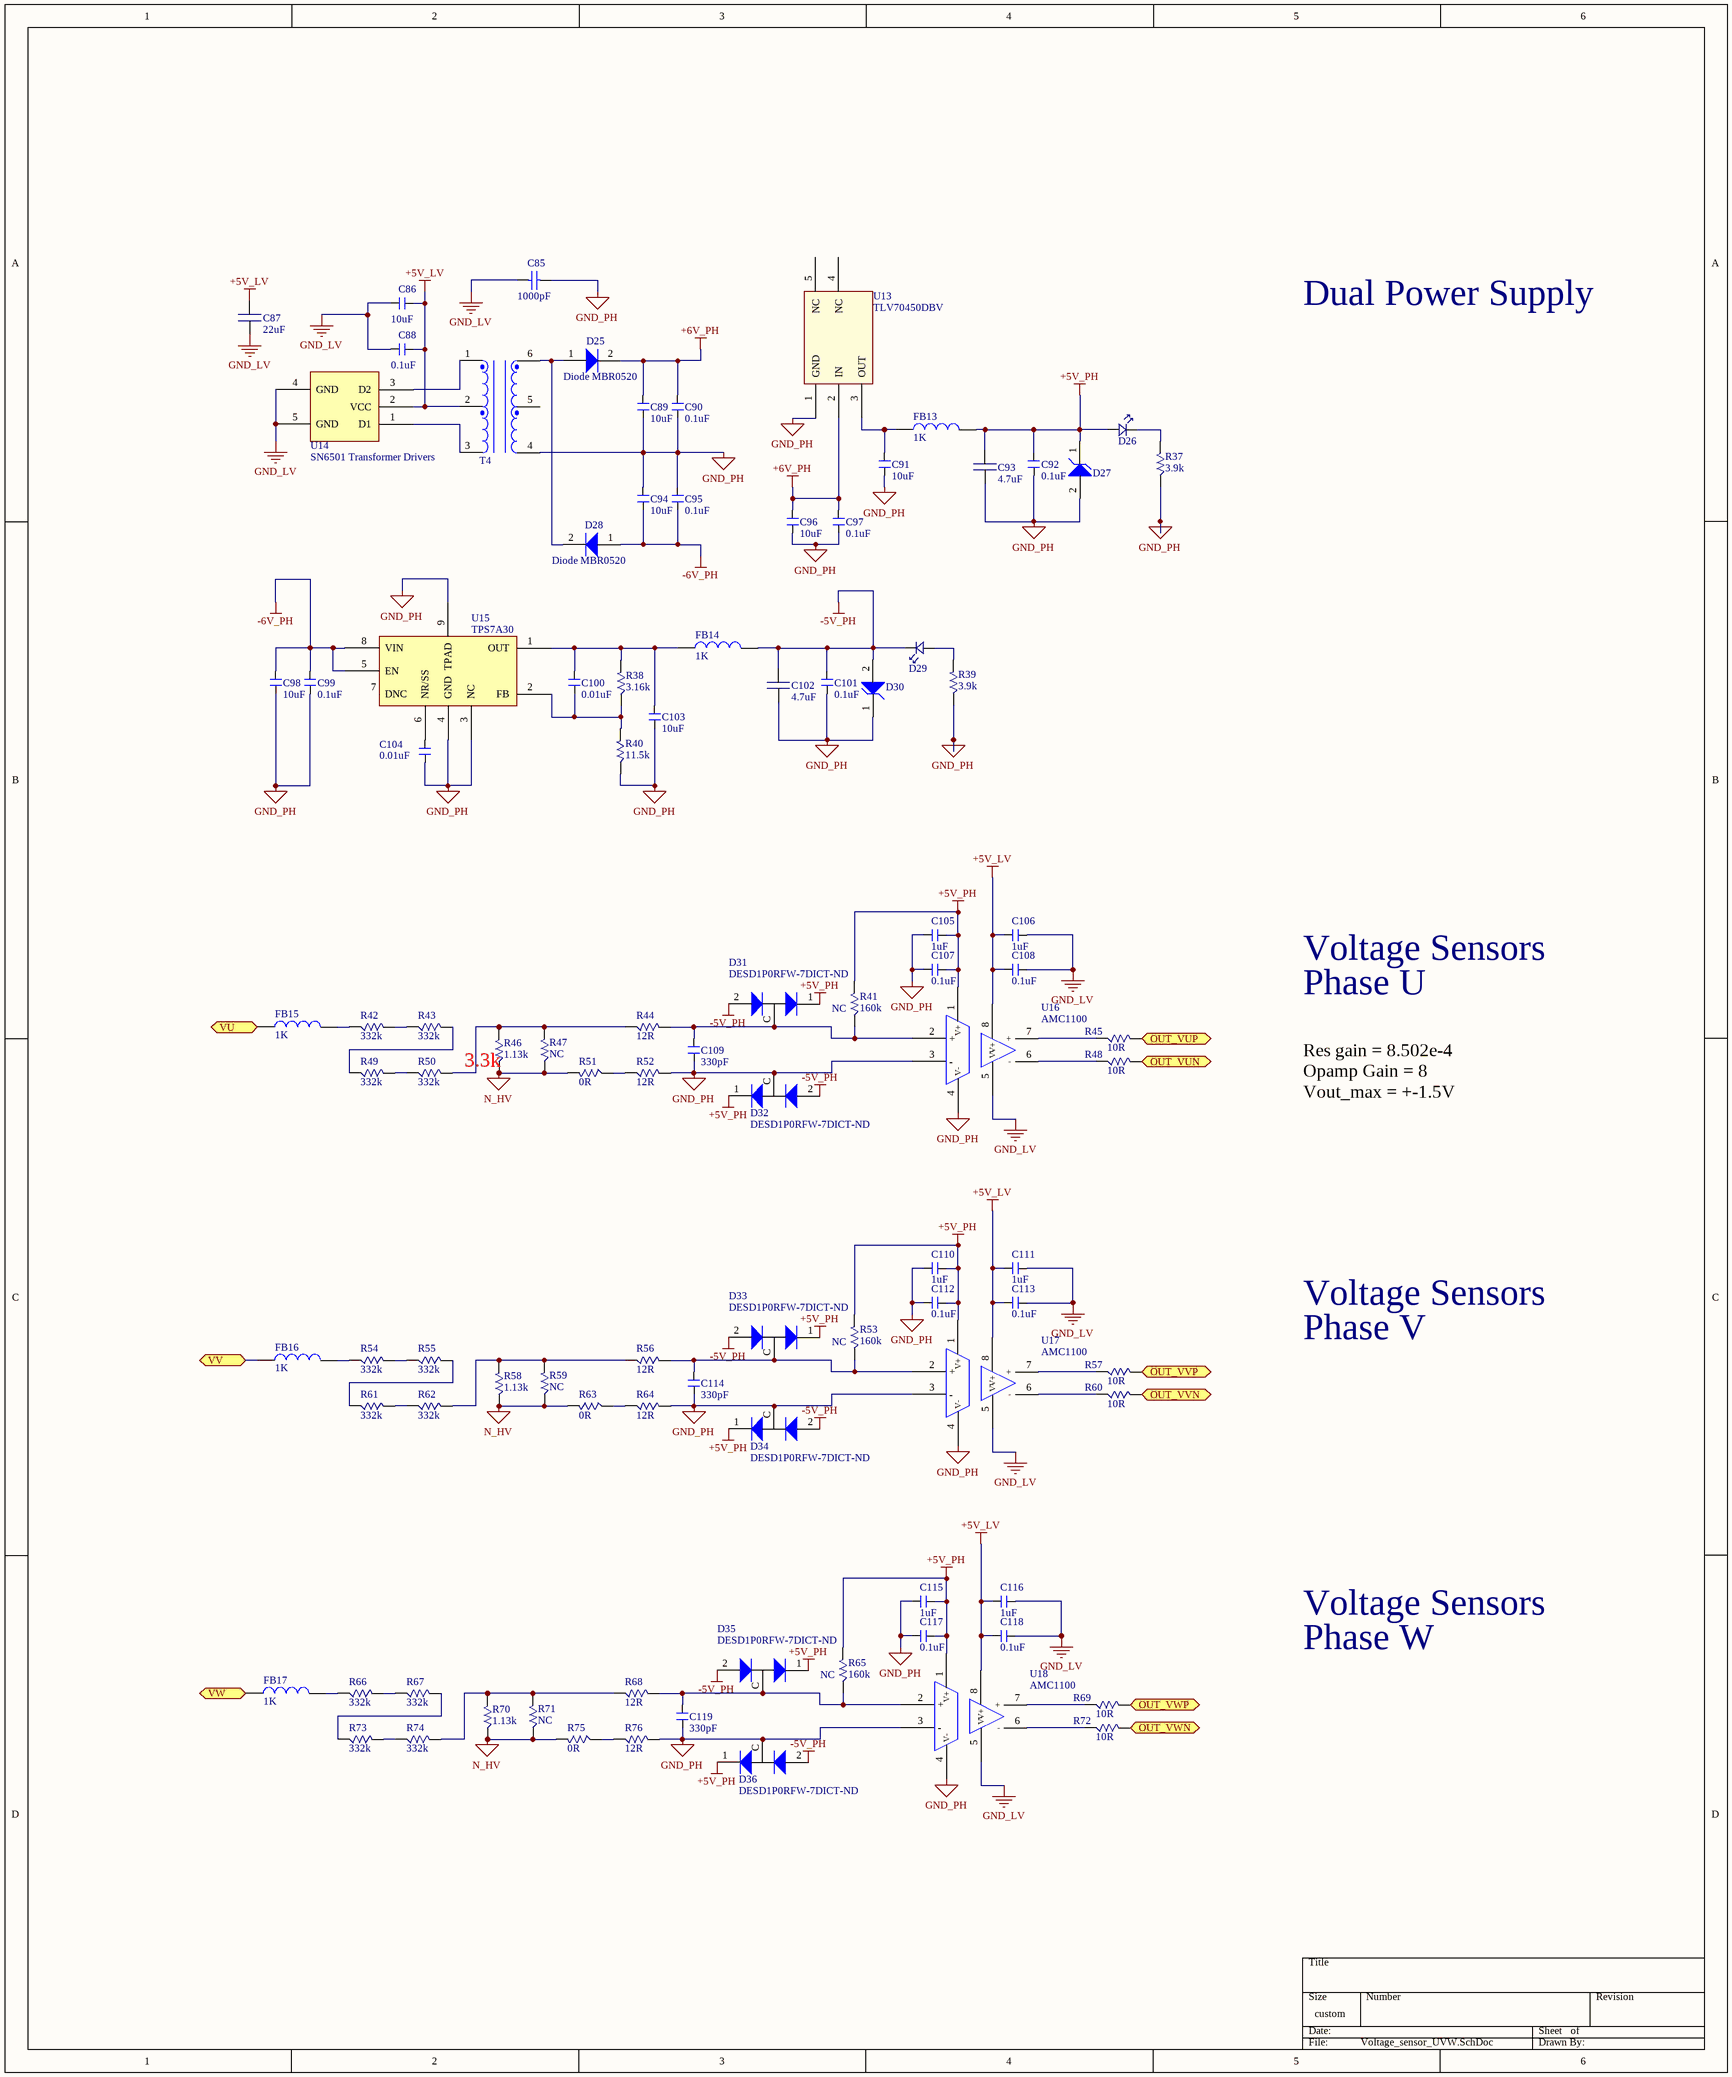
[diagram p3: Voltage_sensor_UVW.SchDoc]

### Parts
C85  value 1000pF  [RAD-0.3]  (hidden comment: Cap TH)
C86  value 10uF  [0603 (1608 Metric)]  (hidden comment: Cap 0603_new)
C87  value 22uF  [0805 (2012 metric)]  (hidden comment: Cap 0805)
C88  value 0.1uF  [0603 (1608 Metric)]  (hidden comment: Cap 0603_new)
C89  value 10uF  [0603 (1608 Metric)]  (hidden comment: Cap 0603_new)
C90  value 0.1uF  [0603 (1608 Metric)]  (hidden comment: Cap 0603_new)
C91  value 10uF  [0603 (1608 Metric)]  (hidden comment: Cap 0603_new)
C92  value 0.1uF  [0603 (1608 Metric)]  (hidden comment: Cap 0603_new)
C93  value 4.7uF  [0805 (2012 metric)]  (hidden comment: Cap 0805)
C94  value 10uF  [0603 (1608 Metric)]  (hidden comment: Cap 0603_new)
C95  value 0.1uF  [0603 (1608 Metric)]  (hidden comment: Cap 0603_new)
C96  value 10uF  [0603 (1608 Metric)]  (hidden comment: Cap 0603_new)
C97  value 0.1uF  [0603 (1608 Metric)]  (hidden comment: Cap 0603_new)
C98  value 10uF  [0603 (1608 Metric)]  (hidden comment: Cap 0603_new)
C99  value 0.1uF  [0603 (1608 Metric)]  (hidden comment: Cap 0603_new)
C100  value 0.01uF  [0603 (1608 Metric)]  (hidden comment: Cap 0603_new)
C101  value 0.1uF  [0603 (1608 Metric)]  (hidden comment: Cap 0603_new)
C102  value 4.7uF  [0805 (2012 metric)]  (hidden comment: Cap 0805)
C103  value 10uF  [0603 (1608 Metric)]  (hidden comment: Cap 0603_new)
C104  value 0.01uF  [0603 (1608 Metric)]  (hidden comment: Cap 0603_new)
C105  value 1uF  [0603 (1608 Metric)]  (hidden comment: Cap 0603_new)
C106  value 1uF  [0603 (1608 Metric)]  (hidden comment: Cap 0603_new)
C107  value 0.1uF  [0603 (1608 Metric)]  (hidden comment: Cap 0603_new)
C108  value 0.1uF  [0603 (1608 Metric)]  (hidden comment: Cap 0603_new)
C109  value 330pF  [0603 (1608 Metric)]  (hidden comment: Cap 0603_new)
C110  value 1uF  [0603 (1608 Metric)]  (hidden comment: Cap 0603_new)
C111  value 1uF  [0603 (1608 Metric)]  (hidden comment: Cap 0603_new)
C112  value 0.1uF  [0603 (1608 Metric)]  (hidden comment: Cap 0603_new)
C113  value 0.1uF  [0603 (1608 Metric)]  (hidden comment: Cap 0603_new)
C114  value 330pF  [0603 (1608 Metric)]  (hidden comment: Cap 0603_new)
C115  value 1uF  [0603 (1608 Metric)]  (hidden comment: Cap 0603_new)
C116  value 1uF  [0603 (1608 Metric)]  (hidden comment: Cap 0603_new)
C117  value 0.1uF  [0603 (1608 Metric)]  (hidden comment: Cap 0603_new)
C118  value 0.1uF  [0603 (1608 Metric)]  (hidden comment: Cap 0603_new)
C119  value 330pF  [0603 (1608 Metric)]  (hidden comment: Cap 0603_new)
D25  Diode MBR0520  [SOD-123]
D26  LED  [0805 (2012 Metric) Diode]  (value not drawn)
D27  *  [POWERDI]  (value not drawn)
D28  Diode MBR0520  [SOD-123]
D29  LED  [0805 (2012 Metric) Diode]  (value not drawn)
D30  *  [POWERDI]  (value not drawn)
D31  Part: DESD1P0RFW-7DICT-ND  [SOT323_ESD]  (hidden comment: TVS - Diodes)
D32  Part: DESD1P0RFW-7DICT-ND  [SOT323_ESD]  (hidden comment: TVS - Diodes)
D33  Part: DESD1P0RFW-7DICT-ND  [SOT323_ESD]  (hidden comment: TVS - Diodes)
D34  Part: DESD1P0RFW-7DICT-ND  [SOT323_ESD]  (hidden comment: TVS - Diodes)
D35  Part: DESD1P0RFW-7DICT-ND  [SOT323_ESD]  (hidden comment: TVS - Diodes)
D36  Part: DESD1P0RFW-7DICT-ND  [SOT323_ESD]  (hidden comment: TVS - Diodes)
FB13  value 1K  [0603 (1608 Metric)]  (hidden comment: Ferrite bead)
FB14  value 1K  [0603 (1608 Metric)]  (hidden comment: Ferrite bead)
FB15  value 1K  [0603 (1608 Metric)]  (hidden comment: Ferrite bead)
FB16  value 1K  [0603 (1608 Metric)]  (hidden comment: Ferrite bead)
FB17  value 1K  [0603 (1608 Metric)]  (hidden comment: Ferrite bead)
R37  value 3.9k  [0603 (1608 Metric)]  (hidden comment: Resistor 0603)
R38  value 3.16k  [0603 (1608 Metric)]  (hidden comment: Resistor 0603)
R39  value 3.9k  [0603 (1608 Metric)]  (hidden comment: Resistor 0603)
R40  value 11.5k  [0603 (1608 Metric)]  (hidden comment: Resistor 0603)
R41  NC  value 160k  [0603 (1608 Metric)]
R42  value 332k  [1206]  (hidden comment: Resistor 1206)
R43  value 332k  [1206]  (hidden comment: Resistor 1206)
R44  value 12R  [1206]  (hidden comment: Resistor 1206)
R45  value 10R  [0603 (1608 Metric)]  (hidden comment: Resistor 0603)
R46  value 1.13k  [1206]  (hidden comment: Resistor 1206)
R47  value NC  [1206]  (hidden comment: Resistor 1206)
R48  value 10R  [0603 (1608 Metric)]  (hidden comment: Resistor 0603)
R49  value 332k  [1206]  (hidden comment: Resistor 1206)
R50  value 332k  [1206]  (hidden comment: Resistor 1206)
R51  value 0R  [0603 (1608 Metric)]  (hidden comment: Resistor 0603)
R52  value 12R  [1206]  (hidden comment: Resistor 1206)
R53  NC  value 160k  [0603 (1608 Metric)]
R54  value 332k  [1206]  (hidden comment: Resistor 1206)
R55  value 332k  [1206]  (hidden comment: Resistor 1206)
R56  value 12R  [1206]  (hidden comment: Resistor 1206)
R57  value 10R  [0603 (1608 Metric)]  (hidden comment: Resistor 0603)
R58  value 1.13k  [1206]  (hidden comment: Resistor 1206)
R59  value NC  [1206]  (hidden comment: Resistor 1206)
R60  value 10R  [0603 (1608 Metric)]  (hidden comment: Resistor 0603)
R61  value 332k  [1206]  (hidden comment: Resistor 1206)
R62  value 332k  [1206]  (hidden comment: Resistor 1206)
R63  value 0R  [0603 (1608 Metric)]  (hidden comment: Resistor 0603)
R64  value 12R  [1206]  (hidden comment: Resistor 1206)
R65  NC  value 160k  [0603 (1608 Metric)]
R66  value 332k  [1206]  (hidden comment: Resistor 1206)
R67  value 332k  [1206]  (hidden comment: Resistor 1206)
R68  value 12R  [1206]  (hidden comment: Resistor 1206)
R69  value 10R  [0603 (1608 Metric)]  (hidden comment: Resistor 0603)
R70  value 1.13k  [1206]  (hidden comment: Resistor 1206)
R71  value NC  [1206]  (hidden comment: Resistor 1206)
R72  value 10R  [0603 (1608 Metric)]  (hidden comment: Resistor 0603)
R73  value 332k  [1206]  (hidden comment: Resistor 1206)
R74  value 332k  [1206]  (hidden comment: Resistor 1206)
R75  value 0R  [0603 (1608 Metric)]  (hidden comment: Resistor 0603)
R76  value 12R  [1206]  (hidden comment: Resistor 1206)
T4  750313769  [Xmr SN6501]  (value not drawn)
U13  TLV70450DBV  [SOT23-5]
U14  SN6501 Transformer Drivers  [SOT23-5]
U15  TPS7A30  [8-TSSOP]
U16  AMC1100  [SOIC8]
U17  AMC1100  [SOIC8]
U18  AMC1100  [SOIC8]

### Ports
OUT_VUN, OUT_VUP, OUT_VVN, OUT_VVP, OUT_VWN, OUT_VWP, VU, VV, VW

### Nets
+5V_LV: C86.2(OUT) C87.2(OUT) C88.2(OUT) C106.1(OUT) C108.1(OUT) C111.1(OUT) C113.1(OUT) C116.1(OUT) C118.1(OUT) T4.2 U14.2(VCC) U16.8(V+) U17.8(V+) U18.8(V+)
+5V_PH: C92.2(OUT) C93.2(OUT) C105.2(OUT) C107.2(OUT) C110.2(OUT) C112.2(OUT) C115.2(OUT) C117.2(OUT) D26.A D27.1(Anode) D31.1(Anode) D32.1(Anode) D33.1(Anode) D34.1(Anode) D35.1(Anode) D36.1(Anode) FB13.2(OUT) R41.2(A) R53.2(A) R65.2(A) U16.1(V+) U17.1(V+) U18.1(V+)
+6V_PH: C89.2(OUT) C90.2(OUT) C96.2(OUT) C97.2(OUT) D25.2(Anode) U13.2(IN)
-5V_PH: C101.2(OUT) C102.2(OUT) D29.K D30.2(Anode) D31.2(Anode) D32.2(Anode) D33.2(Anode) D34.2(Anode) D35.2(Anode) D36.2(Anode) FB14.2(OUT)
-6V_PH: C94.1(OUT) C95.1(OUT) C98.2(OUT) C99.2(OUT) D28.1(Anode) U15.5(EN) U15.8(VIN)
GND_LV: C85.1 C86.1(OUT) C87.1(OUT) C88.1(OUT) C106.2(OUT) C108.2(OUT) C111.2(OUT) C113.2(OUT) C116.2(OUT) C118.2(OUT) U14.4(GND) U14.5(GND) U16.5(V-) U17.5(V-) U18.5(V-)
GND_PH: C85.2 C89.1(OUT) C90.1(OUT) C91.1(OUT) C92.1(OUT) C93.1(OUT) C94.2(OUT) C95.2(OUT) C96.1(OUT) C97.1(OUT) C98.1(OUT) C99.1(OUT) C101.1(OUT) C102.1(OUT) C103.1(OUT) C104.1(OUT) C105.1(OUT) C107.1(OUT) C109.2(OUT) C110.1(OUT) C112.1(OUT) C114.2(OUT) C115.1(OUT) C117.1(OUT) C119.2(OUT) D27.2(Anode) D30.1(Anode) D32.C(Cathode) D34.C(Cathode) D36.C(Cathode) R37.1(A) R39.1(A) R40.1(A) R52.2(A) R64.2(A) R76.2(A) T4.4 U13.1(GND) U15.3(NC) U15.4(GND) U15.9(TPAD) U16.3(-) U16.4(V-) U17.3(-) U17.4(V-) U18.3(-) U18.4(V-)
N_HV: R46.1(A) R47.1(A) R51.2(A) R58.1(A) R59.1(A) R63.2(A) R70.1(A) R71.1(A) R75.2(A)
NetC1_3: FB15.1(OUT) ; port VU
NetC4_3: FB16.1(OUT) ; port VV
NetC7_3: FB17.1(OUT) ; port VW
NetC91_2: C91.2(OUT) FB13.1(OUT) U13.3(OUT)
NetC100_1: C100.1(OUT) C103.2(OUT) FB14.1(OUT) R38.2(A) U15.1(OUT)
NetC100_2: C100.2(OUT) R38.1(A) R40.2(A) U15.2(FB)
NetC104_2: C104.2(OUT) U15.6(NR/SS)
NetC109_1: C109.1(OUT) D31.C(Cathode) R41.1(A) R44.2(A) U16.2(+)
NetC114_1: C114.1(OUT) D33.C(Cathode) R53.1(A) R56.2(A) U17.2(+)
NetC119_1: C119.1(OUT) D35.C(Cathode) R65.1(A) R68.2(A) U18.2(+)
NetD25_1: D25.1(Anode) D28.2(Anode) T4.6
NetD26_K: D26.K R37.2(A)
NetD29_A: D29.A R39.2(A)
NetFB15_2: FB15.2(OUT) R42.1(A)
NetFB16_2: FB16.2(OUT) R54.1(A)
NetFB17_2: FB17.2(OUT) R66.1(A)
NetR42_2: R42.2(A) R43.1(A)
NetR43_2: R43.2(A) R49.1(A)
NetR44_1: R44.1(A) R46.2(A) R47.2(A) R50.2(A)
NetR45_1: R45.1(A) U16.7(+)
NetR45_2: R45.2(A) ; port OUT_VUP
NetR48_1: R48.1(A) U16.6(-)
NetR48_2: R48.2(A) ; port OUT_VUN
NetR49_2: R49.2(A) R50.1(A)
NetR51_1: R51.1(A) R52.1(A)
NetR54_2: R54.2(A) R55.1(A)
NetR55_2: R55.2(A) R61.1(A)
NetR56_1: R56.1(A) R58.2(A) R59.2(A) R62.2(A)
NetR57_1: R57.1(A) U17.7(+)
NetR57_2: R57.2(A) ; port OUT_VVP
NetR60_1: R60.1(A) U17.6(-)
NetR60_2: R60.2(A) ; port OUT_VVN
NetR61_2: R61.2(A) R62.1(A)
NetR63_1: R63.1(A) R64.1(A)
NetR66_2: R66.2(A) R67.1(A)
NetR67_2: R67.2(A) R73.1(A)
NetR68_1: R68.1(A) R70.2(A) R71.2(A) R74.2(A)
NetR69_1: R69.1(A) U18.7(+)
NetR69_2: R69.2(A) ; port OUT_VWP
NetR72_1: R72.1(A) U18.6(-)
NetR72_2: R72.2(A) ; port OUT_VWN
NetR73_2: R73.2(A) R74.1(A)
NetR75_1: R75.1(A) R76.1(A)
NetT4_1: T4.1 U14.3(D2)
NetT4_3: T4.3 U14.1(D1)

Not connected (* = marked no-connect by the designer): T4 5(1); U13 4(NC) 5(NC); U15 7(DNC)

### Notes on the sheet
- Dual Power Supply
- Voltage Sensors
- Phase U
- (near R46) 3.3k
- Res gain = 8.502e-4
  Opamp Gain = 8
  Vout_max = +-1.5V
  Maximum Voltage= +- 220.5
- Phase V
- Phase W

### Library data of the parts
C85 = Cap: as C15 on sheet Ind_current_sensor_VW; Published: 8-Jun-2000; LatestRevisionDate: 17-Jul-2002; LatestRevisionNote: Re-released for DXP Platform.; PackageReference: RAD-0.3; Publisher: Altium Limited; PackageDescription: Radial Cap, Thru-Hole; 2 Leads; 0.3 in Pin Spacing
C86 C89 C91 C94 C96 C98 C103 = Cap 0603_new: as C16 on sheet Ind_current_sensor_VW
C87 = Cap 0805: as C17 on sheet Ind_current_sensor_VW
C88 C90 C92 C95 C97 C99 C101 C107 C108 C112 C113 C117 C118 = Cap 0603_new: as C12 on sheet Ind_current_sensor_VW
C93 C102 = Cap 0805: as C23 on sheet Ind_current_sensor_VW
C100 C104 = Cap 0603_new: as C30 on sheet Ind_current_sensor_VW
C105 C106 C110 C111 C115 C116 = Cap 0603_new: as C10 on sheet Ind_current_sensor_VW
C109 C114 C119 = Cap 0603_new: as C14 on sheet Ind_current_sensor_VW
D25 D28 = Diode MBR0520: as D3 on sheet Ind_current_sensor_VW; Value: *
D26 D29 = LED: LED 0805
D27 D30 = Diode Zener POWERDI123: Part: MMSZ5228B-FDICT-ND; Value: *
D31-D36 = Diode_ESD: TVS DIODE 70VWM 8VC SOT323; Value: ESD
FB13-FB17 = Ferrite bead: as FB1 on sheet Ind_current_sensor_VW
R37 R39 = Resistor 0603: as R15 on sheet Ind_current_sensor_VW
R38 = Resistor 0603: as R16 on sheet Ind_current_sensor_VW
R40 = Resistor 0603: as R18 on sheet Ind_current_sensor_VW
R41 R53 R65 = Resistor 0603
R42 R43 R49 R50 R54 R55 R61 R62 R66 R67 R73 R74 = Resistor 1206: RES SMD 332K OHM 0.1% 1/4W 1206; Part: RG32P332KBCT-ND
R44 R52 R56 R64 R68 R76 = Resistor 1206: as R11 on sheet Ind_current_sensor_VW
R45 R48 R57 R60 R69 R72 = Resistor 0603: as R12 on sheet Ind_current_sensor_VW
R46 R58 R70 = Resistor 1206: RES SMD 1.13K OHM 0.1% 1/4W 1206; Part: P1.13KBCCT-ND
T4 = 750313769: as T1 on sheet Ind_current_sensor_VW
U13 = TLV70450DBV: as U2 on sheet Ind_current_sensor_VW
U14 = SN6501: as U3 on sheet Ind_current_sensor_VW; Value: *
U15 = TPS7A30: as U4 on sheet Ind_current_sensor_VW
U16-U18 = AMC1100: as U1 on sheet Ind_current_sensor_VW